# Altium schematic sheet led_matrix.SchDoc
size A3; SheetNumber: 2; SheetTotal: 2; SPICEModelCacheWOCWTUTU: <root> / <DocumentId>WOCWTUTU</DocumentId> / <CacheFrame Number="0"> / <Model Name="led1" Kind="MDL"> / <Text>*Typ RED GaAs LED: Vf=1.7V Vr=4V If=40mA trr=3uS / *LED Pinout: 1=A, 2=K / .MODEL LED1 D (IS=93.2P RS=42M N=3.73 BV=4 IBV=10U / + CJO=2.97P VJ=.75 M=.333 TT=4.32U)</Text> / </Model> / </CacheFrame> / </root>
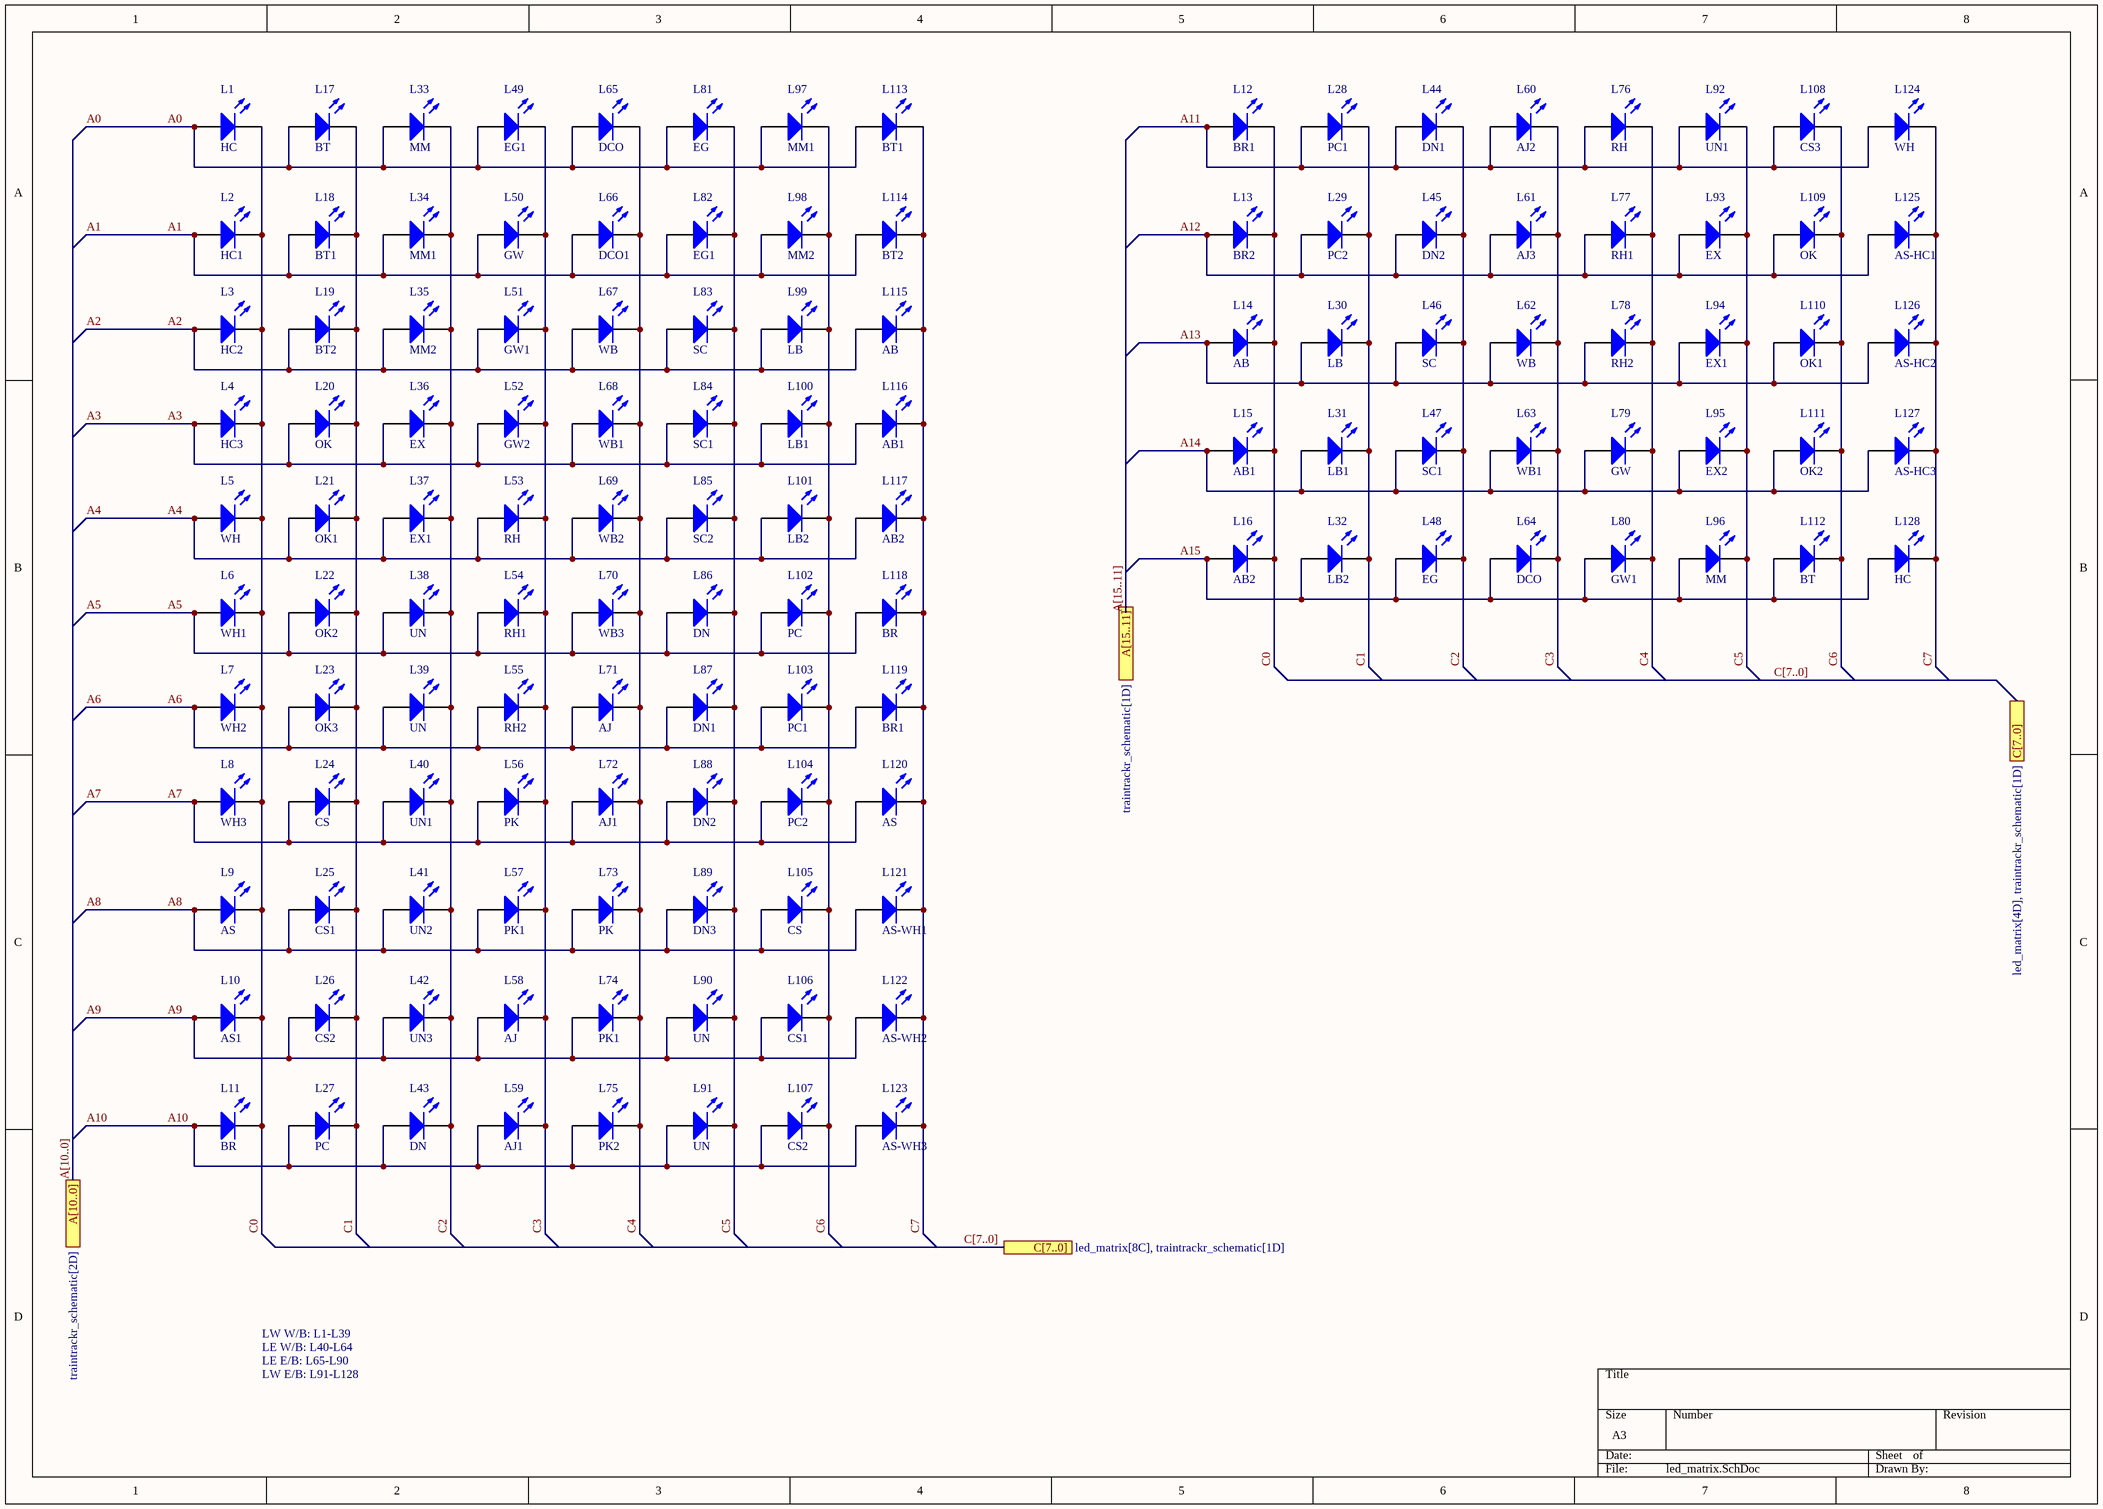
[diagram p0: led_matrix.SchDoc]

## Parts
L1  HC  [PCBComponent_1]
L2  HC1  [PCBComponent_1]
L3  HC2  [PCBComponent_1]
L4  HC3  [PCBComponent_1]
L5  WH  [PCBComponent_1]
L6  WH1  [PCBComponent_1]
L7  WH2  [PCBComponent_1]
L8  WH3  [PCBComponent_1]
L9  AS  [PCBComponent_1]
L10  AS1  [PCBComponent_1]
L11  BR  [PCBComponent_1]
L12  BR1  [PCBComponent_1]
L13  BR2  [PCBComponent_1]
L14  AB  [PCBComponent_1]
L15  AB1  [PCBComponent_1]
L16  AB2  [PCBComponent_1]
L17  BT  [PCBComponent_1]
L18  BT1  [PCBComponent_1]
L19  BT2  [PCBComponent_1]
L20  OK  [PCBComponent_1]
L21  OK1  [PCBComponent_1]
L22  OK2  [PCBComponent_1]
L23  OK3  [PCBComponent_1]
L24  CS  [PCBComponent_1]
L25  CS1  [PCBComponent_1]
L26  CS2  [PCBComponent_1]
L27  PC  [PCBComponent_1]
L28  PC1  [PCBComponent_1]
L29  PC2  [PCBComponent_1]
L30  LB  [PCBComponent_1]
L31  LB1  [PCBComponent_1]
L32  LB2  [PCBComponent_1]
L33  MM  [PCBComponent_1]
L34  MM1  [PCBComponent_1]
L35  MM2  [PCBComponent_1]
L36  EX  [PCBComponent_1]
L37  EX1  [PCBComponent_1]
L38  UN  [PCBComponent_1]
L39  UN  [PCBComponent_1]
L40  UN1  [PCBComponent_1]
L41  UN2  [PCBComponent_1]
L42  UN3  [PCBComponent_1]
L43  DN  [PCBComponent_1]
L44  DN1  [PCBComponent_1]
L45  DN2  [PCBComponent_1]
L46  SC  [PCBComponent_1]
L47  SC1  [PCBComponent_1]
L48  EG  [PCBComponent_1]
L49  EG1  [PCBComponent_1]
L50  GW  [PCBComponent_1]
L51  GW1  [PCBComponent_1]
L52  GW2  [PCBComponent_1]
L53  RH  [PCBComponent_1]
L54  RH1  [PCBComponent_1]
L55  RH2  [PCBComponent_1]
L56  PK  [PCBComponent_1]
L57  PK1  [PCBComponent_1]
L58  AJ  [PCBComponent_1]
L59  AJ1  [PCBComponent_1]
L60  AJ2  [PCBComponent_1]
L61  AJ3  [PCBComponent_1]
L62  WB  [PCBComponent_1]
L63  WB1  [PCBComponent_1]
L64  DCO  [PCBComponent_1]
L65  DCO  [PCBComponent_1]
L66  DCO1  [PCBComponent_1]
L67  WB  [PCBComponent_1]
L68  WB1  [PCBComponent_1]
L69  WB2  [PCBComponent_1]
L70  WB3  [PCBComponent_1]
L71  AJ  [PCBComponent_1]
L72  AJ1  [PCBComponent_1]
L73  PK  [PCBComponent_1]
L74  PK1  [PCBComponent_1]
L75  PK2  [PCBComponent_1]
L76  RH  [PCBComponent_1]
L77  RH1  [PCBComponent_1]
L78  RH2  [PCBComponent_1]
L79  GW  [PCBComponent_1]
L80  GW1  [PCBComponent_1]
L81  EG  [PCBComponent_1]
L82  EG1  [PCBComponent_1]
L83  SC  [PCBComponent_1]
L84  SC1  [PCBComponent_1]
L85  SC2  [PCBComponent_1]
L86  DN  [PCBComponent_1]
L87  DN1  [PCBComponent_1]
L88  DN2  [PCBComponent_1]
L89  DN3  [PCBComponent_1]
L90  UN  [PCBComponent_1]
L91  UN  [PCBComponent_1]
L92  UN1  [PCBComponent_1]
L93  EX  [PCBComponent_1]
L94  EX1  [PCBComponent_1]
L95  EX2  [PCBComponent_1]
L96  MM  [PCBComponent_1]
L97  MM1  [PCBComponent_1]
L98  MM2  [PCBComponent_1]
L99  LB  [PCBComponent_1]
L100  LB1  [PCBComponent_1]
L101  LB2  [PCBComponent_1]
L102  PC  [PCBComponent_1]
L103  PC1  [PCBComponent_1]
L104  PC2  [PCBComponent_1]
L105  CS  [PCBComponent_1]
L106  CS1  [PCBComponent_1]
L107  CS2  [PCBComponent_1]
L108  CS3  [PCBComponent_1]
L109  OK  [PCBComponent_1]
L110  OK1  [PCBComponent_1]
L111  OK2  [PCBComponent_1]
L112  BT  [PCBComponent_1]
L113  BT1  [PCBComponent_1]
L114  BT2  [PCBComponent_1]
L115  AB  [PCBComponent_1]
L116  AB1  [PCBComponent_1]
L117  AB2  [PCBComponent_1]
L118  BR  [PCBComponent_1]
L119  BR1  [PCBComponent_1]
L120  AS  [PCBComponent_1]
L121  AS-WH1  [PCBComponent_1]
L122  AS-WH2  [PCBComponent_1]
L123  AS-WH3  [PCBComponent_1]
L124  WH  [PCBComponent_1]
L125  AS-HC1  [PCBComponent_1]
L126  AS-HC2  [PCBComponent_1]
L127  AS-HC3  [PCBComponent_1]
L128  HC  [PCBComponent_1]

## Ports
A[10..0] (see traintrackr_schematic[2D]), A[15..11] (see traintrackr_schematic[1D]), C[7..0] (see led_matrix[4D], traintrackr_schematic[1D]), C[7..0] (see led_matrix[8C], traintrackr_schematic[1D])

## Nets
A0: L1.1(A) L17.1(A) L33.1(A) L49.1(A) L65.1(A) L81.1(A) L97.1(A) L113.1(A)
A1: L2.1(A) L18.1(A) L34.1(A) L50.1(A) L66.1(A) L82.1(A) L98.1(A) L114.1(A)
A2: L3.1(A) L19.1(A) L35.1(A) L51.1(A) L67.1(A) L83.1(A) L99.1(A) L115.1(A)
A3: L4.1(A) L20.1(A) L36.1(A) L52.1(A) L68.1(A) L84.1(A) L100.1(A) L116.1(A)
A4: L5.1(A) L21.1(A) L37.1(A) L53.1(A) L69.1(A) L85.1(A) L101.1(A) L117.1(A)
A5: L6.1(A) L22.1(A) L38.1(A) L54.1(A) L70.1(A) L86.1(A) L102.1(A) L118.1(A)
A6: L7.1(A) L23.1(A) L39.1(A) L55.1(A) L71.1(A) L87.1(A) L103.1(A) L119.1(A)
A7: L8.1(A) L24.1(A) L40.1(A) L56.1(A) L72.1(A) L88.1(A) L104.1(A) L120.1(A)
A8: L9.1(A) L25.1(A) L41.1(A) L57.1(A) L73.1(A) L89.1(A) L105.1(A) L121.1(A)
A9: L10.1(A) L26.1(A) L42.1(A) L58.1(A) L74.1(A) L90.1(A) L106.1(A) L122.1(A)
A10: L11.1(A) L27.1(A) L43.1(A) L59.1(A) L75.1(A) L91.1(A) L107.1(A) L123.1(A)
A11: L12.1(A) L28.1(A) L44.1(A) L60.1(A) L76.1(A) L92.1(A) L108.1(A) L124.1(A)
A12: L13.1(A) L29.1(A) L45.1(A) L61.1(A) L77.1(A) L93.1(A) L109.1(A) L125.1(A)
A13: L14.1(A) L30.1(A) L46.1(A) L62.1(A) L78.1(A) L94.1(A) L110.1(A) L126.1(A)
A14: L15.1(A) L31.1(A) L47.1(A) L63.1(A) L79.1(A) L95.1(A) L111.1(A) L127.1(A)
A15: L16.1(A) L32.1(A) L48.1(A) L64.1(A) L80.1(A) L96.1(A) L112.1(A) L128.1(A)
C0: L1.2(K) L2.2(K) L3.2(K) L4.2(K) L5.2(K) L6.2(K) L7.2(K) L8.2(K) L9.2(K) L10.2(K) L11.2(K) L12.2(K) L13.2(K) L14.2(K) L15.2(K) L16.2(K)
C1: L17.2(K) L18.2(K) L19.2(K) L20.2(K) L21.2(K) L22.2(K) L23.2(K) L24.2(K) L25.2(K) L26.2(K) L27.2(K) L28.2(K) L29.2(K) L30.2(K) L31.2(K) L32.2(K)
C2: L33.2(K) L34.2(K) L35.2(K) L36.2(K) L37.2(K) L38.2(K) L39.2(K) L40.2(K) L41.2(K) L42.2(K) L43.2(K) L44.2(K) L45.2(K) L46.2(K) L47.2(K) L48.2(K)
C3: L49.2(K) L50.2(K) L51.2(K) L52.2(K) L53.2(K) L54.2(K) L55.2(K) L56.2(K) L57.2(K) L58.2(K) L59.2(K) L60.2(K) L61.2(K) L62.2(K) L63.2(K) L64.2(K)
C4: L65.2(K) L66.2(K) L67.2(K) L68.2(K) L69.2(K) L70.2(K) L71.2(K) L72.2(K) L73.2(K) L74.2(K) L75.2(K) L76.2(K) L77.2(K) L78.2(K) L79.2(K) L80.2(K)
C5: L81.2(K) L82.2(K) L83.2(K) L84.2(K) L85.2(K) L86.2(K) L87.2(K) L88.2(K) L89.2(K) L90.2(K) L91.2(K) L92.2(K) L93.2(K) L94.2(K) L95.2(K) L96.2(K)
C6: L97.2(K) L98.2(K) L99.2(K) L100.2(K) L101.2(K) L102.2(K) L103.2(K) L104.2(K) L105.2(K) L106.2(K) L107.2(K) L108.2(K) L109.2(K) L110.2(K) L111.2(K) L112.2(K)
C7: L113.2(K) L114.2(K) L115.2(K) L116.2(K) L117.2(K) L118.2(K) L119.2(K) L120.2(K) L121.2(K) L122.2(K) L123.2(K) L124.2(K) L125.2(K) L126.2(K) L127.2(K) L128.2(K)

## Buses and harness runs
bus A[10..0] = port A[10..0]
bus A[15..11] = port A[15..11]
bus C[7..0] = port C[7..0]

## Notes on the sheet
- LW W/B: L1-L39
- LE W/B: L40-L64
- LE E/B: L65-L90
- LW E/B: L91-L128

## Library data of the parts
L1-L128 = LED1: Typical RED GaAs LED; Published: 8-Jun-2000; LatestRevisionDate: 08-Jul-2005; LatestRevisionNote: Mech Layer 1 removed.; PackageReference: LED-1; Publisher: Altium Limited; PackageDescription: LED; 2 Leads